# EAGLE design beba (EAGLE 9.6.2)
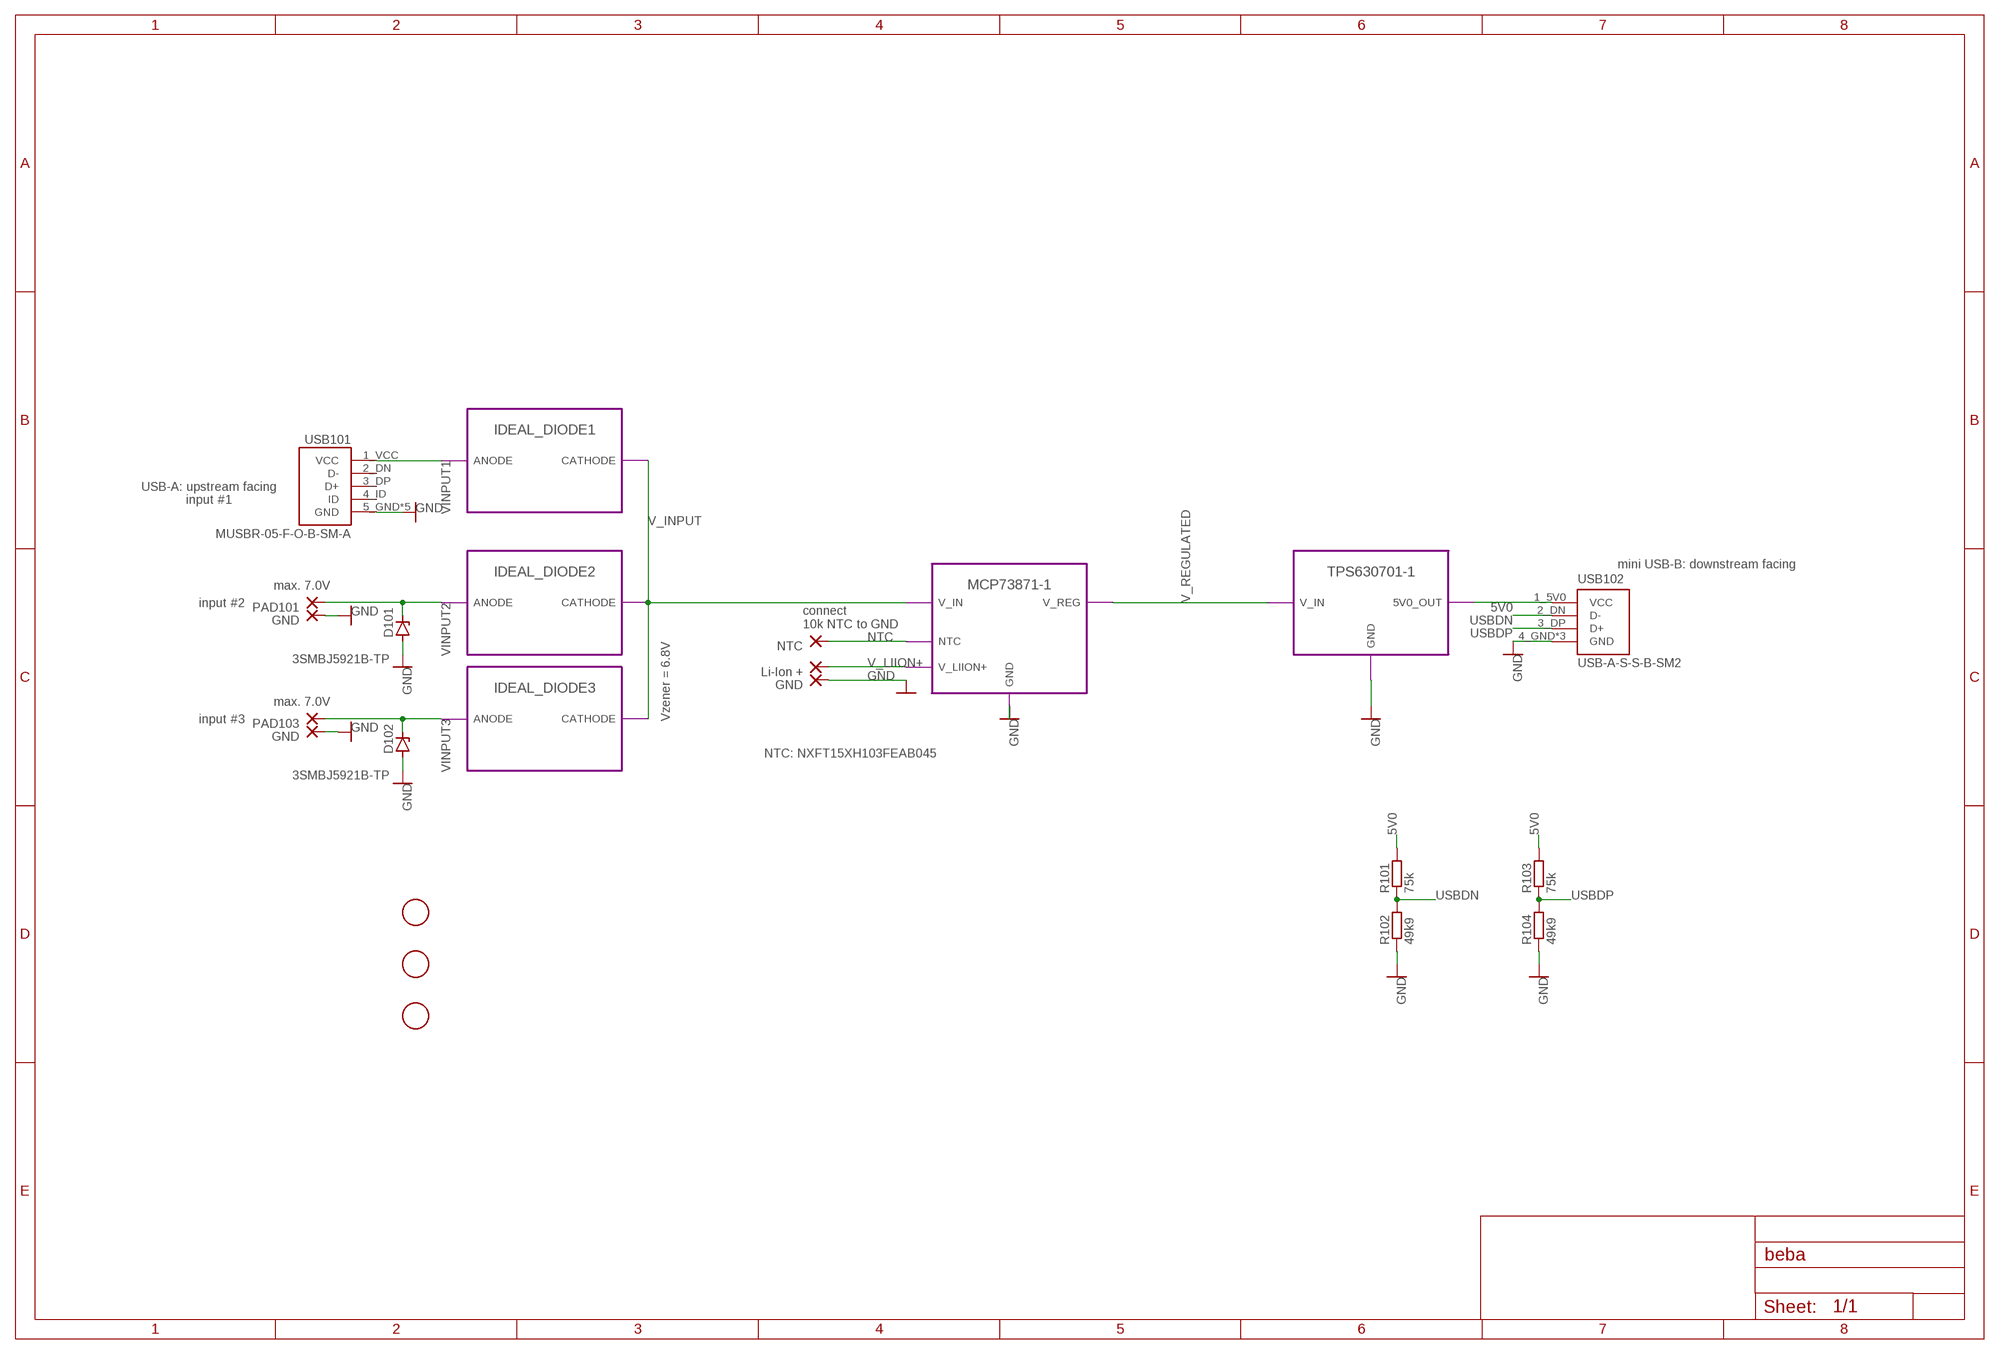
[diagram p0: schematic, sheet 1]

## Parts
D101  3SMBJ5921B-TP  ZENER-DIODEDO214AA  [DO214AA]
D102  3SMBJ5921B-TP  ZENER-DIODEDO214AA  [DO214AA]
FID1  fiducial  FIDUCIALFID_0.5MM  [FIDUCIAL_0.5MM]
FID2  fiducial  FIDUCIALFID_0.5MM  [FIDUCIAL_0.5MM]
FID3  fiducial  FIDUCIALFID_0.5MM  [FIDUCIAL_0.5MM]
PAD101  IN2  SMD5  [SMD2,54-5,08]
PAD102  GND  SMD5  [SMD2,54-5,08]
PAD103  IN3  SMD5  [SMD2,54-5,08]
PAD104  GND  SMD5  [SMD2,54-5,08]
PAD105  NTC  SMD5  [SMD2,54-5,08]
PAD106  Li-Ion +  SMD5  [SMD2,54-5,08]
PAD107  GND  SMD5  [SMD2,54-5,08]
R101  75k  R-EU_R0805  [R0805]
R102  49k9  R-EU_R0805  [R0805]
R103  75k  R-EU_R0805  [R0805]
R104  49k9  R-EU_R0805  [R0805]
USB101  MUSBR-05-F-O-B-SM-A  [SAMTEC_MUSBR-05-F-O-B-SM-A]
USB102  USB-A-S-S-B-SM2  USB-A-S-X-X-SM2  [SAMTEC_USB-A-S-X-X-SM2]

## Module instances
IDEAL_DIODE1 = 1_IDEAL_DIODE (part numbers offset by 200)
IDEAL_DIODE2 = 1_IDEAL_DIODE (part numbers offset by 300)
IDEAL_DIODE3 = 1_IDEAL_DIODE (part numbers offset by 400)
TPS630701-1 = 2_TPS630701 (part numbers offset by 600)
MCP73871-1 = 3_MCP73871 (part numbers offset by 500)

## Nets
5V0 [V_input]: R101.2 R103.2 USB102.1_5V0(VCC) ; port TPS630701-1.5V0_OUT
GND: D101.A D102.A PAD102.1(P) PAD104.1(P) PAD107.1(P) R102.1 R104.1 USB101.5_GND(GND) USB101.G1(GND) USB101.G2(GND) USB101.G3(GND) USB101.G4(GND) USB102.4_GND(GND) USB102.G1(GND) USB102.G2(GND) ; port TPS630701-1.GND MCP73871-1.GND
NTC: PAD105.1(P) ; port MCP73871-1.NTC
USBDN [other]: R101.1 R102.2 USB102.2_DN(D-)
USBDP [other]: R103.1 R104.2 USB102.3_DP(D+)
V_INPUT [V_input]: port IDEAL_DIODE1.CATHODE IDEAL_DIODE2.CATHODE IDEAL_DIODE3.CATHODE MCP73871-1.V_IN
V_LIION+ [V_input]: PAD106.1(P) ; port MCP73871-1.V_LIION+
V_REGULATED [V_input]: port MCP73871-1.V_REG TPS630701-1.V_IN
VINPUT1 [V_input]: USB101.1_VCC(VCC) ; port IDEAL_DIODE1.ANODE
VINPUT2 [V_input]: D101.C PAD101.1(P) ; port IDEAL_DIODE2.ANODE
VINPUT3 [V_input]: D102.C PAD103.1(P) ; port IDEAL_DIODE3.ANODE
Unconnected: USB101.2_DN(D-) USB101.3_DP(D+) USB101.4_ID(ID)

## Notes on the sheet
- USB-A: upstream facing
- input #1
- mini USB-B: downstream facing
- max. 7.0V
- input #2
- connect 
  10k NTC to GND
- Vzener = 6.8V
- max. 7.0V
- input #3
- NTC: NXFT15XH103FEAB045

## Library data of the parts
D101 D102 = diode:ZENER-DIODE: Z-Diode
FID1-FID3 = fiducials:FIDUCIAL
PAD101-PAD107 = wirepad:SMD5: SMD PAD
R101-R104 = resistor:R-EU_: RESISTOR, European symbol
USB101 = MUSBR-05-F-O-B-SM-A - Mini USB B Jack:MUSBR-05-F-O-B-SM-A: USB - mini B USB 2.0 Receptacle Connector 5 Position Surface Mount, Right Angle Check availability <https://pricing.snapeda.com/parts/MUSBR-05-F-O-B-SM-A/Samtec%20Inc./view-part?ref=eda>; AVAILABILITY: In Stock; DESCRIPTION: USB - mini B USB 2.0 Receptacle Connector 5 Position Surface Mount, Right Angle; MF: Samtec Inc.; MP: MUSBR-05-F-O-B-SM-A; PACKAGE: None; PRICE: None; PURCHASE-URL: https://pricing.snapeda.com/search/part/MUSBR-05-F-O-B-SM-A/?ref=eda
USB102 = USB-A-S-S-B-SM2 - USB A Jack:USB-A-S-X-X-SM2: USB-A (USB TYPE-A) USB 2.0 Receptacle Connector 4 Position Surface Mount, Right Angle; Through Hole Check availability <https://pricing.snapeda.com/parts/USB-A-S-S-B-SM2/Samtec%20Inc./view-part?ref=eda>; AVAILABILITY: In Stock; DESCRIPTION: USB-A (USB TYPE-A) USB 2.0 Receptacle Connector 4 Position Surface Mount, Right Angle; MF: Samtec Inc.; MP: USB-A-S-S-B-SM2; PACKAGE: None; PRICE: None; PURCHASE-URL: https://pricing.snapeda.com/search/part/USB-A-S-S-B-SM2/?ref=eda

## Module 1_IDEAL_DIODE
Ports: ANODE(pwr) CATHODE(pwr)
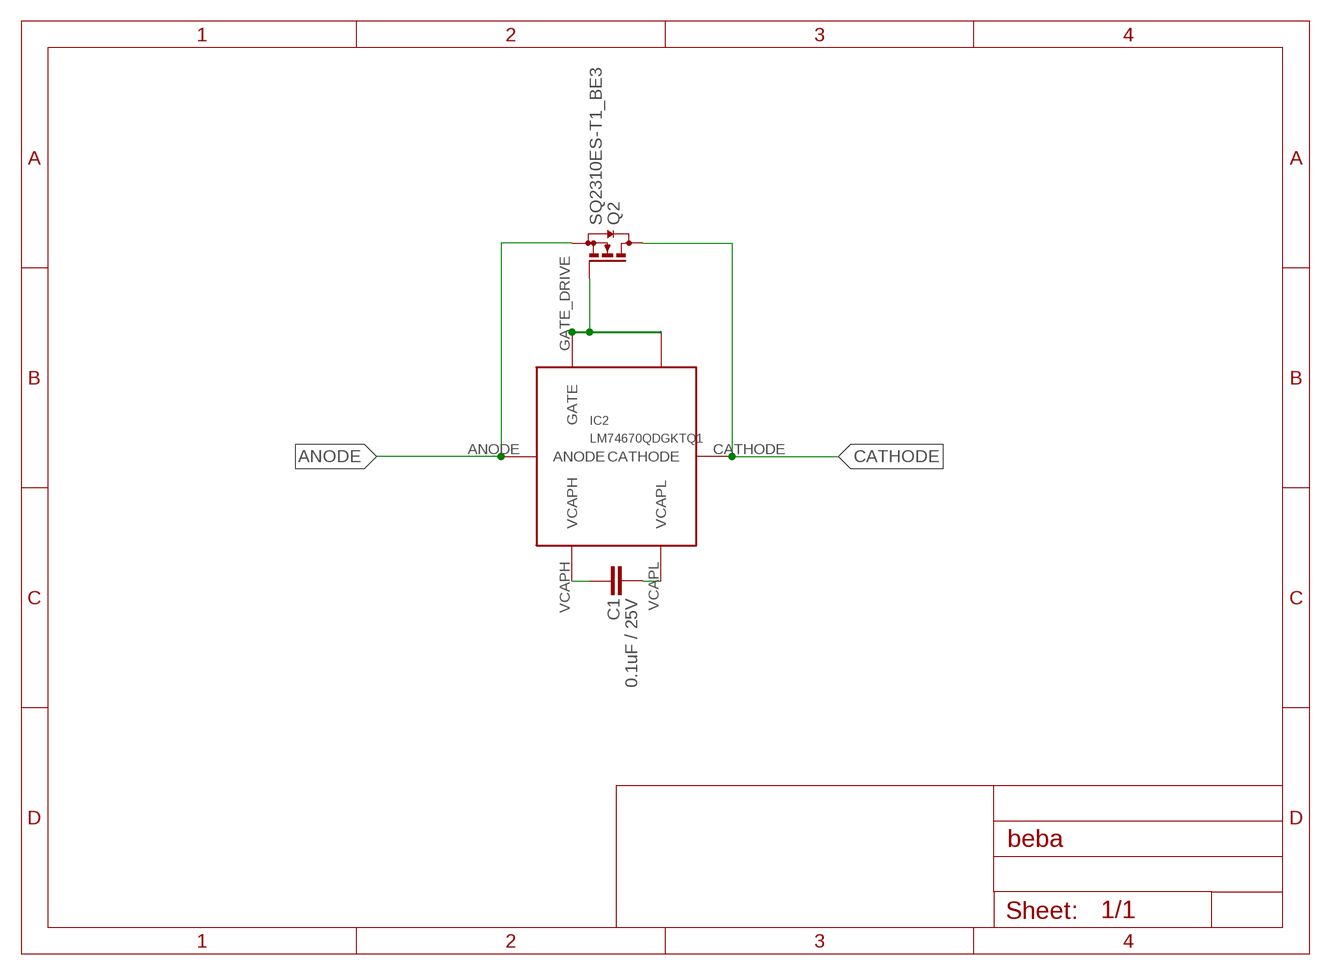
[diagram p1: schematic, module 1_IDEAL_DIODE, sheet 1]

### Parts
C1  0.1uF / 25V  C-EUC0805  [C0805]
IC2  LM74670QDGKTQ1  LM74670  [VSSOP-8]
Q2  SQ2310ES-T1_BE3  BSS123  [SOT23]

### Nets
ANODE: IC2.ANODE Q2.2(S)
CATHODE: IC2.CATHODE Q2.3(D)
GATE_DRIVER [other]: IC2.GATE_DRIVE(GATE) IC2.GATE_PULLD Q2.1(G)
VCAPH [other]: C1.2 IC2.VCAPH
VCAPL [other]: C1.1 IC2.VCAPL

### Library data of the parts
C1 = rcl:C-EU: CAPACITOR, European symbol; SPICEPREFIX: C
IC2 = LM74670 - Smart Diode Rectifier Controller:LM74670
Q2 = transistor-small-signal:BSS123: N-CHANNEL MOS FET

## Module 2_TPS630701
Ports: GND(pwr) V_IN(pwr) 5V0_OUT(pwr)
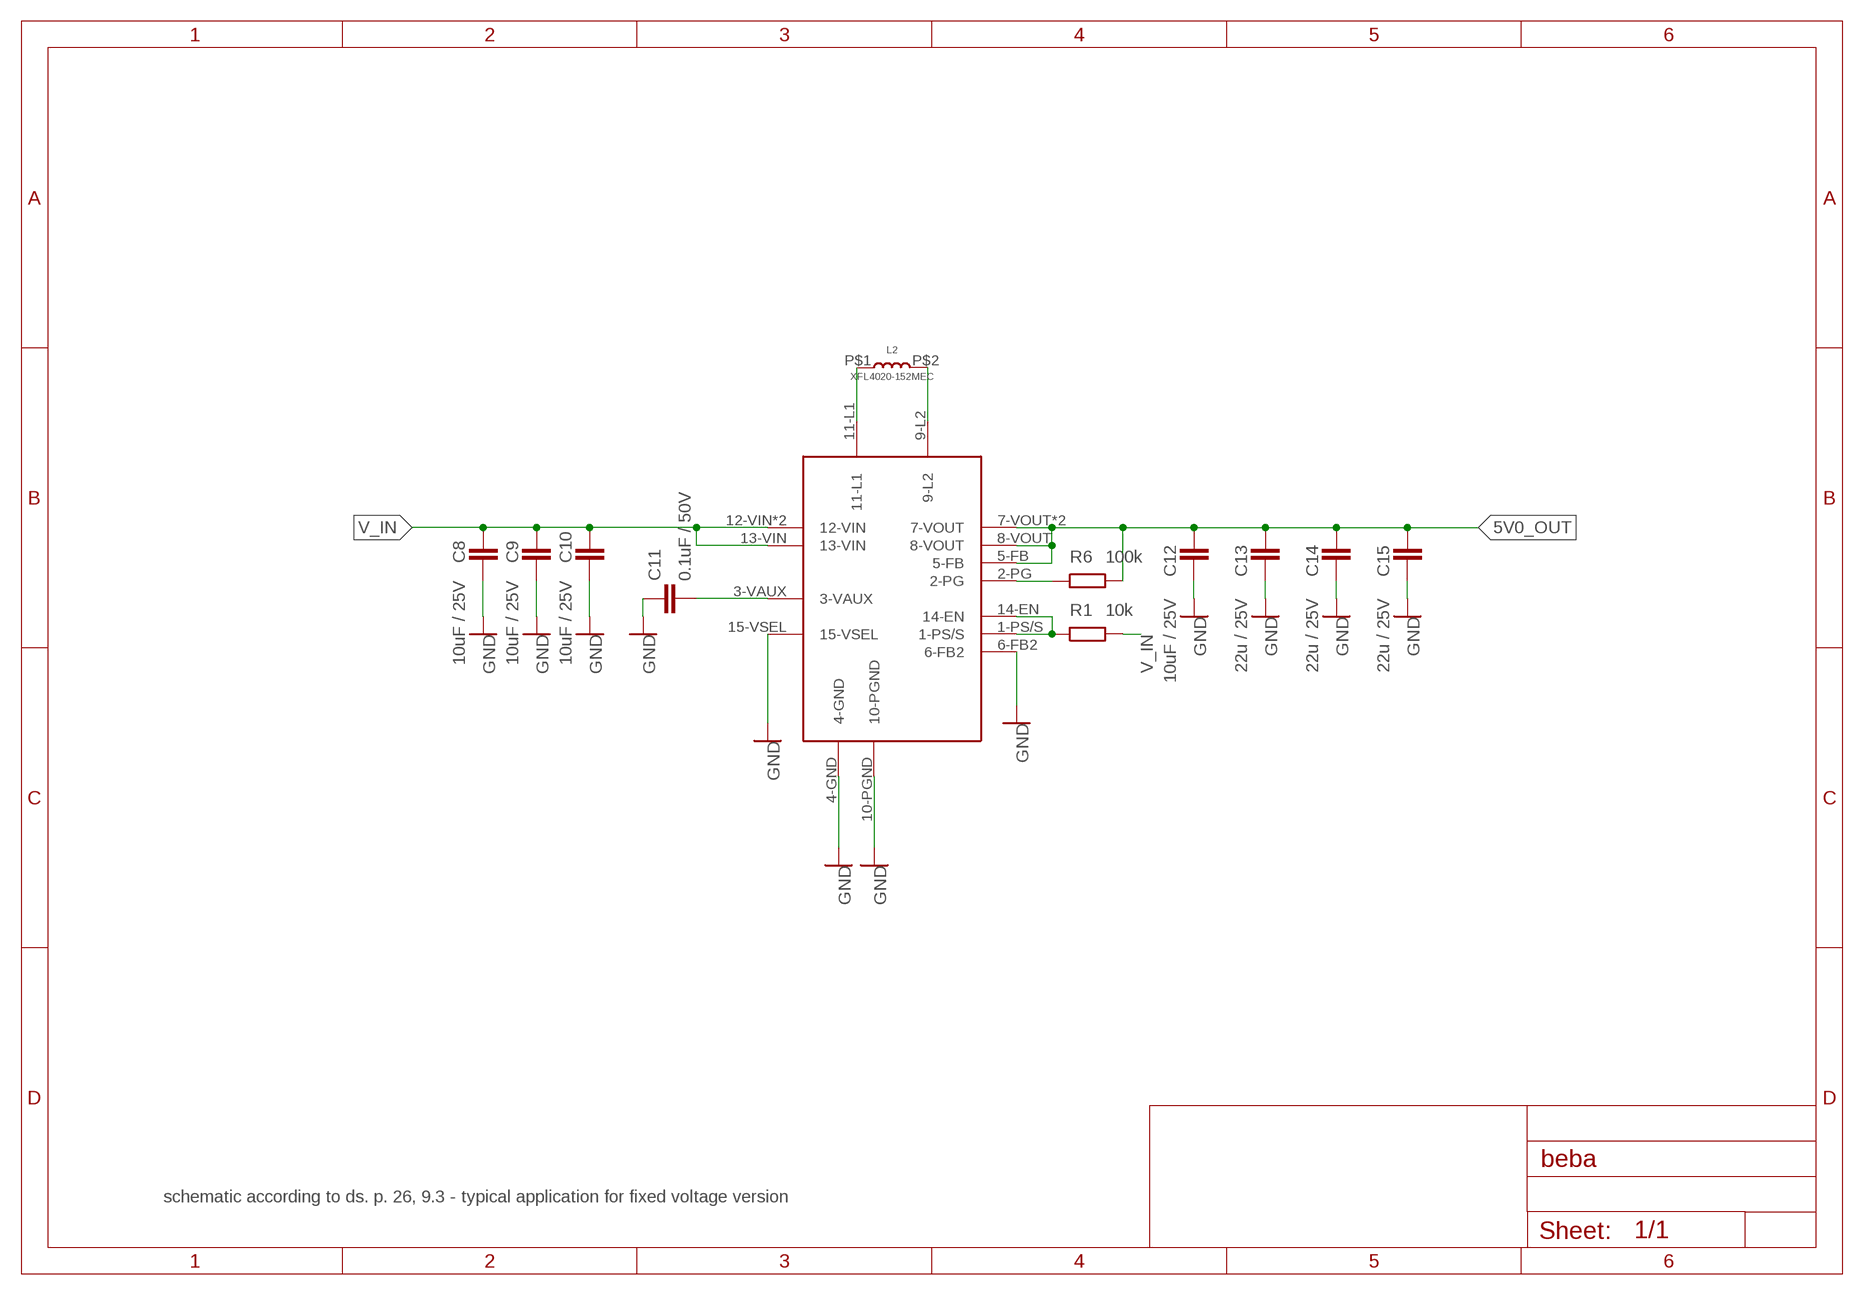
[diagram p2: schematic, module 2_TPS630701, sheet 1]

### Parts
C8  10uF / 25V  C-EUC0805  [C0805]
C9  10uF / 25V  C-EUC0805  [C0805]
C10  10uF / 25V  C-EUC0805  [C0805]
C11  0.1uF / 50V  C-EUC0805  [C0805]
C12  10uF / 25V  C-EUC0805  [C0805]
C13  22u / 25V  C-EUC0805  [C0805]
C14  22u / 25V  C-EUC0805  [C0805]
C15  22u / 25V  C-EUC0805  [C0805]
IC1  TPS630701RNMT  TPS630701  [VQFN]
L2  XFL4020-152MEC  [1616]
R1  10k  R-EU_R0805  [R0805]
R6  100k  R-EU_R0805  [R0805]

### Nets
5V0_OUT [V_input]: C12.2 C13.2 C14.2 C15.2 IC1.5-FB IC1.7-VOUT IC1.8-VOUT IC1.VOUT(7-VOUT) R6.2
GND: C8.1 C9.1 C10.1 C11.1 C12.1 C13.1 C14.1 C15.1 IC1.4-GND IC1.6-FB2 IC1.10-PGND IC1.15-VSEL
L1: IC1.11-L1 L2.P$1
L2: IC1.9-L2 L2.P$2
N$8 [other]: IC1.1-PS/S IC1.14-EN R1.1
PG1 [other]: IC1.2-PG R6.1
V_IN [V_input]: C8.2 C9.2 C10.2 IC1.12-VIN IC1.13-VIN IC1.VIN(12-VIN) R1.2
VAUX [other]: C11.2 IC1.3-VAUX

### Notes on the sheet
- schematic according to ds. p. 26, 9.3 - typical application for fixed voltage version

### Library data of the parts
C8-C15 = rcl:C-EU: CAPACITOR, European symbol; SPICEPREFIX: C
IC1 = TPS630701 - Buck Boost 5V regulator:TPS630701
L2 = XFL4020 - Inductor:XFL4020-152MEC
R1 R6 = resistor:R-EU_: RESISTOR, European symbol

## Module 3_MCP73871
Ports: GND(pwr) V_IN(pwr) V_LIION+(pwr) V_REG(pwr) NTC(hiz)
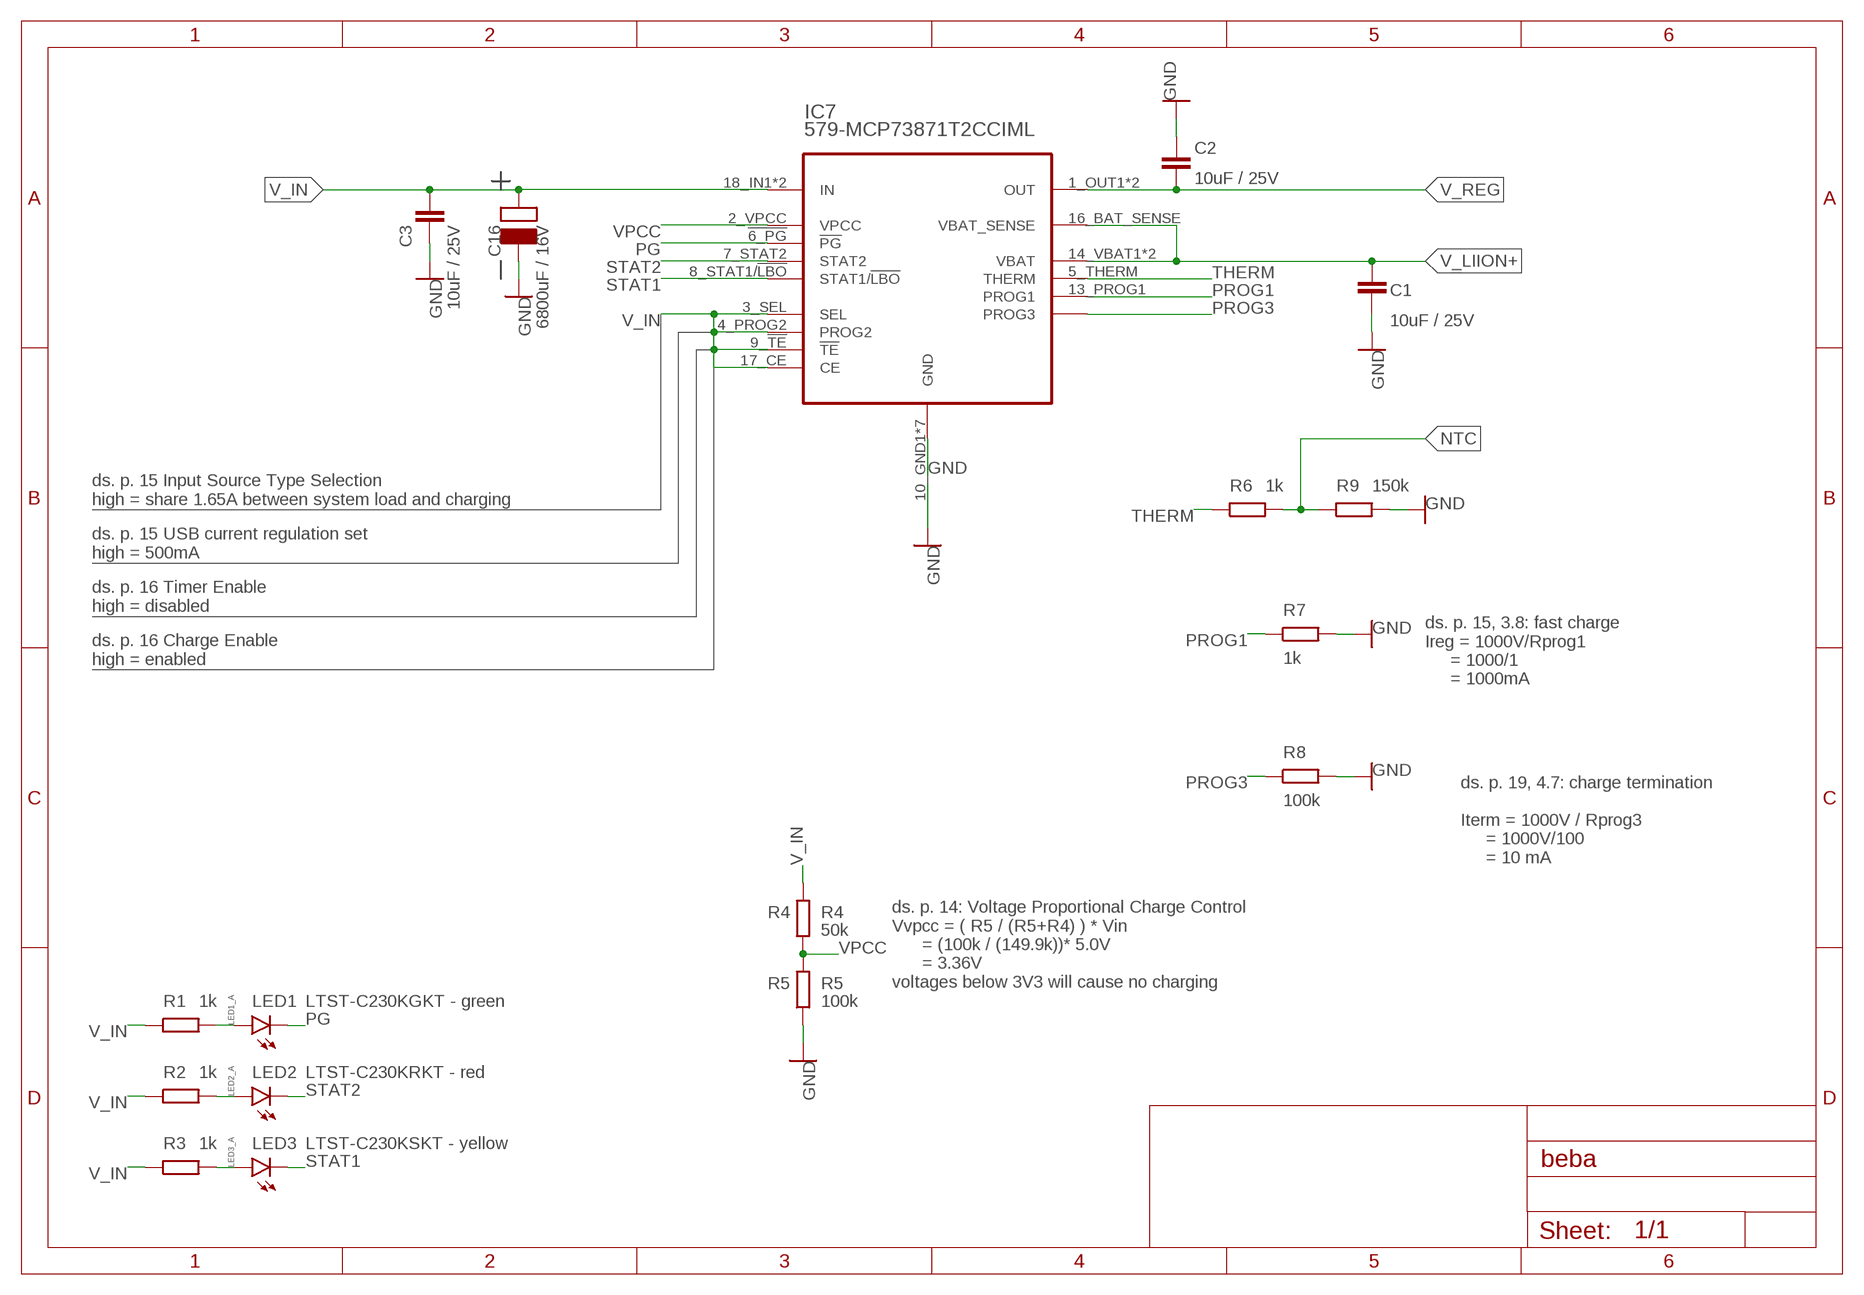
[diagram p3: schematic, module 3_MCP73871, sheet 1]

### Parts
C1  10uF / 25V  C-EUC0805  [C0805]
C2  10uF / 25V  C-EUC0805  [C0805]
C3  10uF / 25V  C-EUC0805  [C0805]
C16  6800uF / 16V  C-POL  [TH]
IC7  579-MCP73871T2CCIML  MCP73871-2AAI/ML  [QFN50P400X400X100-21N]
LED1  LTST-C230KGKT - green  LEDSML1206  [SML1206]
LED2  LTST-C230KRKT - red  LEDSML1206  [SML1206]
LED3  LTST-C230KSKT - yellow  LEDSML1206  [SML1206]
R1  1k  R-EU_R0805  [R0805]
R2  1k  R-EU_R0805  [R0805]
R3  1k  R-EU_R0805  [R0805]
R4  50k  R-EU_R0805  [R0805]
R5  100k  R-EU_R0805  [R0805]
R6  1k  R-EU_R0805  [R0805]
R7  1k  R-EU_R0805  [R0805]
R8  100k  R-EU_R0805  [R0805]
R9  150k  R-EU_R0805  [R0805]

### Nets
GND: C1.2 C2.2 C3.2 C16.NEG IC7.10_GND1(GND) IC7.11_GND2(GND) IC7.GND2(GND) IC7.GND3(GND) IC7.GND4(GND) IC7.GND5(GND) IC7.GND6(GND) R5.1 R7.2 R8.2 R9.2
LED1_A [other]: LED1.A R1.2
LED2_A [other]: LED2.A R2.2
LED3_A [other]: LED3.A R3.2
NTC [other]: R6.2 R9.1
PG [other]: IC7.!6_PG!(!PG!) LED1.C
PROG1 [other]: IC7.13_PROG1(PROG1) R7.1
PROG3 [other]: IC7.12_PROG3(PROG3) R8.1
STAT1 [other]: IC7.8_STAT1/!LBO!(STAT1/!LBO!) LED3.C
STAT2 [other]: IC7.7_STAT2(STAT2) LED2.C
THERM [other]: IC7.5_THERM(THERM) R6.1
V_IN [V_input]: C3.1 C16.POS IC7.3_SEL(SEL) IC7.4_PROG2(PROG2) IC7.9_!TE!(!TE!) IC7.17_CE(CE) IC7.18_IN1(IN) IC7.19_IN2(IN) R1.1 R2.1 R3.1 R4.2
V_LIION+ [V_input]: C1.1 IC7.14_VBAT1(VBAT) IC7.15_VBAT2(VBAT) IC7.16_BAT_SENSE(VBAT_SENSE)
V_REG [V_input]: C2.1 IC7.1_OUT1(OUT) IC7.20_OUT2(OUT)
VPCC [other]: IC7.2_VPCC(VPCC) R4.1 R5.2

### Notes on the sheet
- ds. p. 15 Input Source Type Selection
  high = share 1.65A between system load and charging
- ds. p. 15 USB current regulation set
  high = 500mA
- ds. p. 16 Timer Enable
  high = disabled
- ds. p. 15, 3.8: fast charge
  Ireg = 1000V/Rprog1
       = 1000/1
       = 1000mA
- ds. p. 16 Charge Enable
  high = enabled
- ds. p. 19, 4.7: charge termination
  
  Iterm = 1000V / Rprog3
       = 1000V/100
       = 10 mA
- ds. p. 14: Voltage Proportional Charge Control
  Vvpcc = ( R5 / (R5+R4) ) * Vin
        = (100k / (149.9k))* 5.0V
        = 3.36V
  voltages below 3V3 will cause no charging
- R4
- R5

### Library data of the parts
C1-C3 = rcl:C-EU: CAPACITOR, European symbol; SPICEPREFIX: C
C16 = C-Pol:C-POL
IC7 = MCP73871 - Powerpath and Charge Controller:MCP73871-2AAI/ML: IC, BATTERY CHARGER, 1A; MPN: MCP73871-2AAI/ML; OC_FARNELL: 1642487; OC_NEWARK: 54M4955; PACKAGE: QFN-20; SUPPLIER: Microchip
LED1-LED3 = led:LED: LED OSRAM: - CHIPLED LG R971, LG N971, LY N971, LG Q971, LY Q971, LO R971, LY R971 LH N974, LH R974 LS Q976, LO Q976, LY Q976 LO Q996 - Hyper CHIPLED LW Q18S LB Q993, LB Q99A, LB R99A - SideLED LS A670, LO A670, LY A670, LG A670, LP A670 LB A673, LV A673, LT A673, LW A673 LH A674 LY A675 LS A676, LA A676, LO A676, LY A676, LW A676 LS A679, LY A679, LG A679 - Hyper Micro SIDELED® LS Y876, LA Y876, LO Y876, LY Y876 LT Y87S - SmartLED LW L88C, LW L88S LB L89C, LB L89S, LG L890 LS L89K, LO L89K, LY L89K LS L896, LA L896, LO L896, LY L896 - TOPLED LS T670, LO T670, LY T670, LG T670, LP T670 LSG T670, LSP T670, LSY T670, LOP T670, LYG T670 LG T671, LOG T671, LSG T671 LB T673, LV T673, LT T673, LW T673 LH T674 LS T676, LA T676, LO T676, LY T676, LB T676, LH T676, LSB T676, LW T676 LB T67C, LV T67C, LT T67C, LS T67K, LO T67K, LY T67K, LW E67C LS E67B, LA E67B, LO E67B, LY E67B, LB E67C, LV E67C, LT E67C LW T67C LS T679, LY T679, LG T679 LS T770, LO T770, LY T770, LG T770, LP T770 LB T773, LV T773, LT T773, LW T773 LH T774 LS E675, LA E675, LY E675, LS T675 LS T776, LA T776, LO T776, LY T776, LB T776 LHGB T686 LT T68C, LB T68C - Hyper Mini TOPLED® LB M676 - Mini TOPLED Santana® LG M470 LS M47K, LO M47K, LY M47K Source: http://www.osram.convergy.de LUXEON: - LUMILED® LXK2-PW12-R00, LXK2-PW12-S00, LXK2-PW14-U00, LXK2-PW14-V00 LXK2-PM12-R00, LXK2-PM12-S00, LXK2-PM14-U00 LXK2-PE12-Q00, LXK2-PE12-R00, LXK2-PE12-S00, LXK2-PE14-T00, LXK2-PE14-U00 LXK2-PB12-K00, LXK2-PB12-L00, LXK2-PB12-M00, LXK2-PB14-N00, LXK2-PB14-P00, LXK2-PB14-Q00 LXK2-PR12-L00, LXK2-PR12-M00, LXK2-PR14-Q00, LXK2-PR14-R00 LXK2-PD12-Q00, LXK2-PD12-R00, LXK2-PD12-S00 LXK2-PH12-R00, LXK2-PH12-S00 LXK2-PL12-P00, LXK2-PL12-Q00, LXK2-PL12-R00 Source: www.luxeon.com KINGBRIGHT: KA-3528ASYC Source: www.kingbright.com
R1-R9 = resistor:R-EU_: RESISTOR, European symbol

## Net classes
0 GND: width 0.25 mm, drill 0.35 mm, clearance 0.2 mm
1 V_input: width 0.25 mm, drill 0.35 mm, clearance 0.2 mm
2 other: width 0.25 mm, drill 0.35 mm, clearance 0.2 mm

## Board
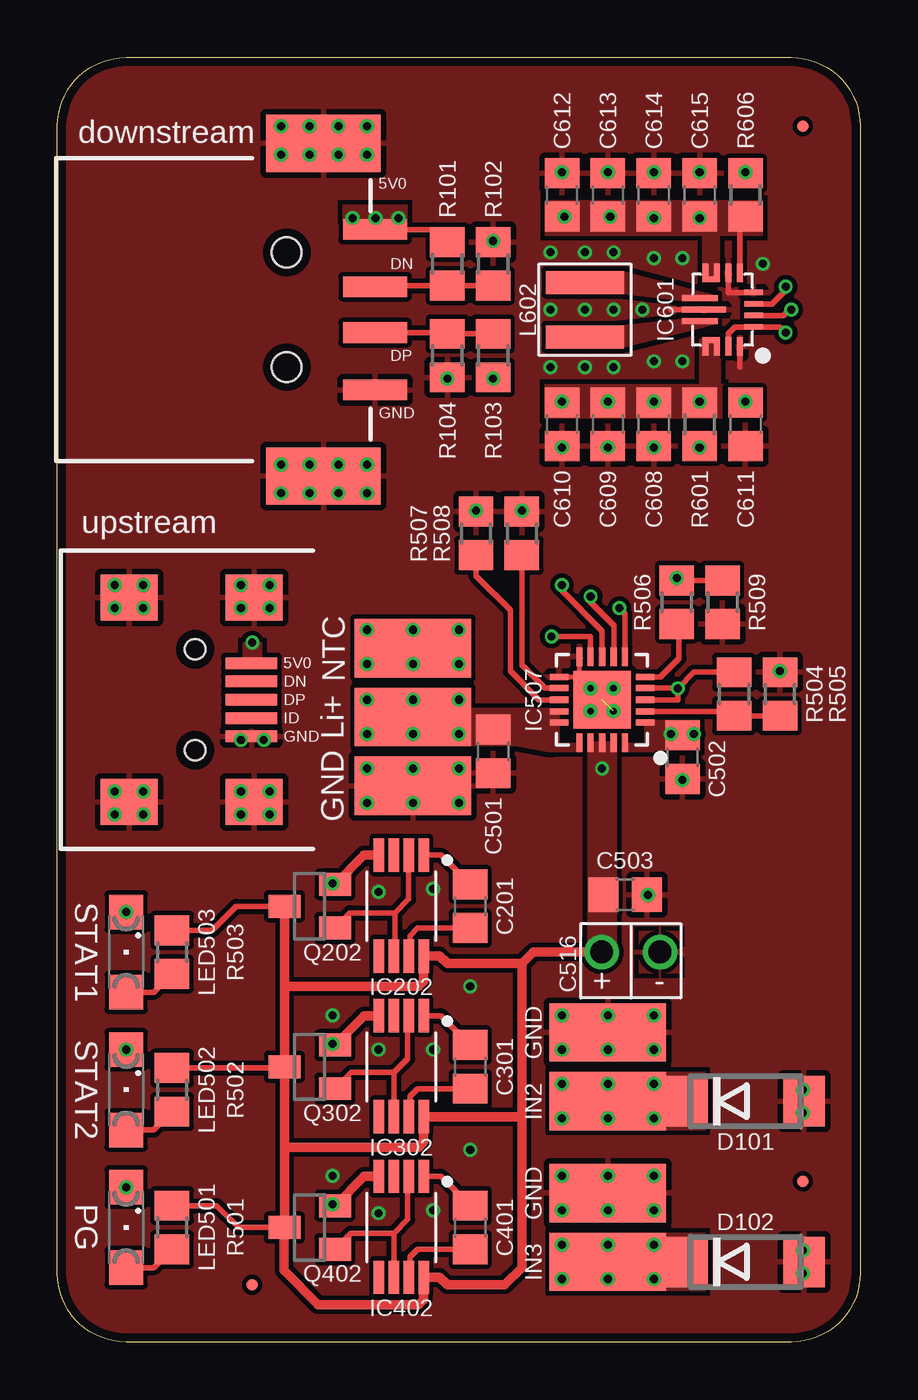
[diagram p4: board, top side]
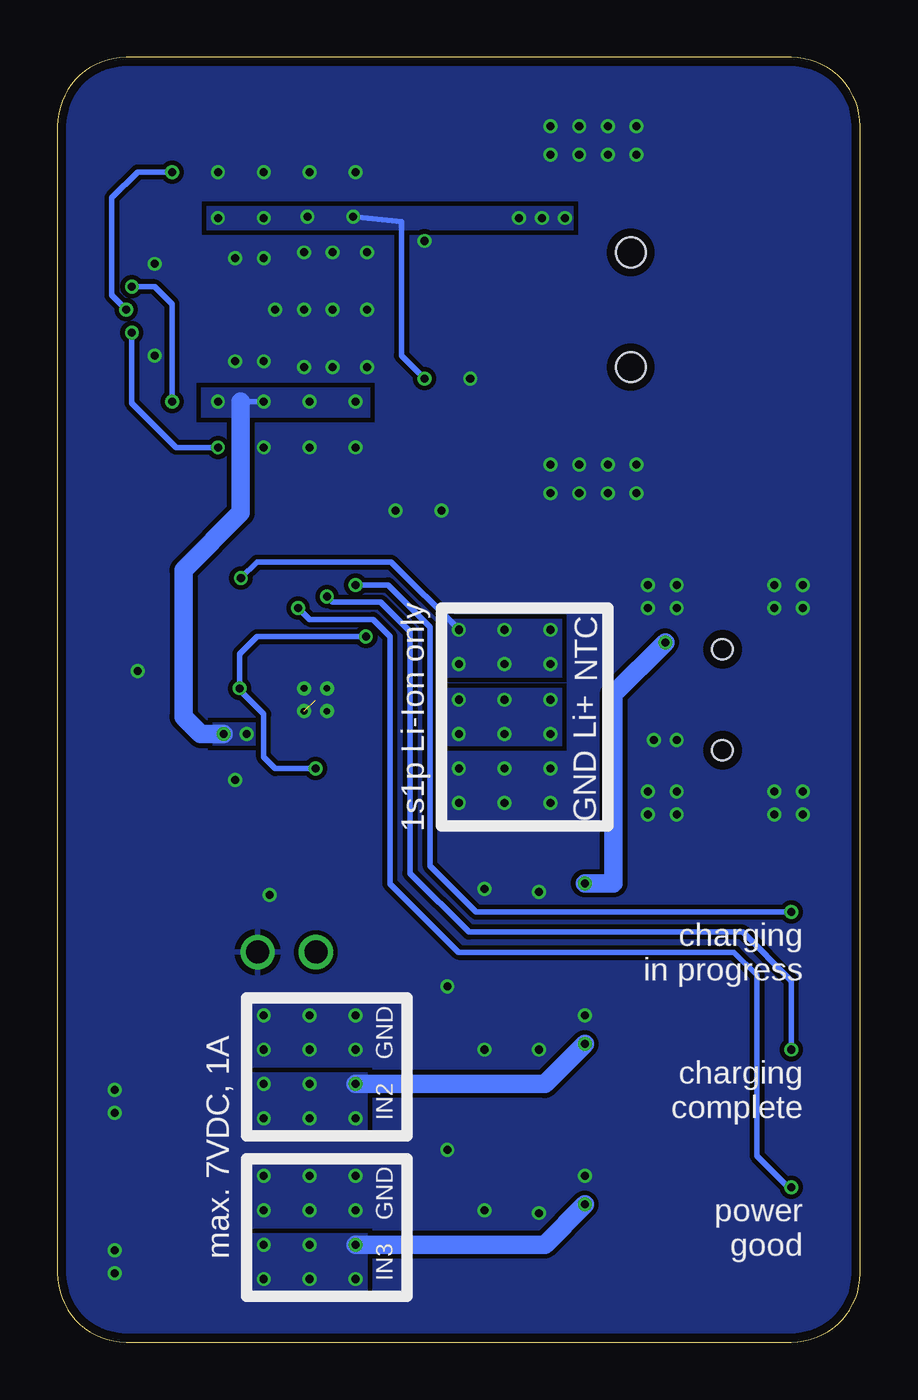
[diagram p5: board, bottom side, seen from below]

Size 35 x 56 mm. Coordinates in mm from the lower left corner, seen from the top.
Outline: 35,53 35,3 arc-90 32,0 3,0 arc-90 0,3 0,53 arc-90 3,56 32,56 arc-90 35,53
Copper layers (1*16): Top 0.035559375mm / dielectric 1.6mm / Bottom 0.035559375mm
Design rules "oshpark-2layer": minimum track width 6mil, minimum drill 10mil, track to track 6mil, track to pad 6mil, pad to pad 6mil, via to via 6mil, smd to smd 6mil, copper to edge 15mil, drill to drill 6mil, minimum pad ring 5mil, minimum via ring 5mil, stop-mask expansion 2.5mil, vias tented up to drill 0mil, thermal gap 10mil
tRestrict: area 23.5,12 to 24.5,12.2; area 23.5,5 to 24.5,5.2; area 15,25.5 to 16,25.8; area 22.4,27.5 to 22.5,28.5; area 25,27.4 to 25.1,28.4; area 23.3,29.2 to 24.3,29.3; area 23.2,26.7 to 24.2,26.8

### Footprints (pad centres in the part's own frame; a part is rotated, then mirrored left to right if it is on the bottom)
C0805 = smd 1.3 x 1.5: 1 -0.95,0; 2 0.95,0
TH = drill 1: NEG 1.27,0; POS -1.27,0
DO214AA = smd 1.8 x 2.2: A 2.55,0; C -2.55,0
FIDUCIAL_0.5MM = smd 0.5 x 0.5: FID 0,0
VSSOP-8 = smd 0.45 x 1.45: ANODE 0.98,-2.23; CATHODE -0.97,2.17; GATE_DRIVE 0.33,2.17; GATE_PULLD -0.32,-2.23; NC1 0.33,-2.23; NC2 0.98,2.17; VCAPH -0.32,2.17; VCAPL -0.97,-2.23
QFN50P400X400X100-21N = smd 0.8 x 0.275: 1_OUT1 -1.88,0.991; 2_VPCC -1.88,0.508; 3_SEL -1.88,0; 4_PROG2 -1.88,-0.508; 5_THERM -1.88,-0.991; 11_GND2 1.88,-0.991; 12_PROG3 1.88,-0.508; 13_PROG1 1.88,0; 14_VBAT1 1.88,0.508; 15_VBAT2 1.88,0.991 | smd 0.275 x 0.8: 7_STAT2 -0.508,-1.88; 8_STAT1/!LBO! 0,-1.88; 9_!TE! 0.508,-1.88; 10_GND1 0.991,-1.88; 16_BAT_SENSE 0.991,1.88; 17_CE 0.508,1.88; 18_IN1 0,1.88; 19_IN2 -0.508,1.88; 20_OUT2 -0.991,1.88; !6_PG! -0.991,-1.88 | smd 2.5 x 2.5: GND2 0,0 | drill 0.3 pad 0.61: GND3 -0.5,-0.5; GND4 0.5,-0.5; GND5 0.5,0.5; GND6 -0.5,0.5
VQFN = smd 0.8 x 0.25: 1-PS/S -1.35,0.75; 2-PG -1.35,0.25; 3-VAUX -1.35,-0.25; 4-GND -1.35,-0.75 | smd 0.25 x 0.8: 5-FB -0.75,-1.6; 6-FB2 -0.25,-1.6; 7-VOUT 0.25,-1.6; 8-VOUT 0.75,-1.6; 12-VIN 0.75,1.6; 13-VIN 0.25,1.6; 14-EN -0.25,1.6; 15-VSEL -0.75,1.6 | smd 1.55 x 0.25: 9-L2 0.99,-0.5; 11-L1 0.99,0.5 | smd 1.9 x 0.25: 10-PGND 0.815,0 | smd 0.6 x 0.25: VIN 0.5,1.325; VOUT 0.505,-1.325
1616 = smd 1 x 3.4: P$1 -1.185,0; P$2 1.185,0
SML1206 = smd 1.5 x 1.5: A 1.75,0; C -1.75,0
SMD2,54-5,08 = smd 2.54 x 5.08: 1 0,0
SOT23 = smd 1 x 1.4: 1 -0.95,-1.1; 2 0.95,-1.1; 3 0,1.1
R0805 = smd 1.3 x 1.5: 1 -0.95,0; 2 0.95,0
SAMTEC_MUSBR-05-F-O-B-SM-A = smd 0.5 x 2.25: 1_VCC 1.6,-2.46; 2_DN 0.8,-2.46; 3_DP 0,-2.46; 4_ID -0.8,-2.46; 5_GND -1.6,-2.46 | smd 2 x 2.5: G1 -4.45,2.87; G2 4.45,2.87; G3 -4.45,-2.58; G4 4.45,-2.58 | hole 0.9: -2.2,0; 2.2,0
SAMTEC_USB-A-S-X-X-SM2 = smd 0.9 x 2.8: 1_5V0 -3.5,3.85; 2_DN -1,3.85; 3_DP 1,3.85; 4_GND 3.5,3.85 | smd 2.5 x 5: G1 -7.25,1.6; G2 7.25,1.6 | hole 1.3: -2.5,0; 2.5,0

### Placement (x,y rotation side)
C201  0.1uF / 25V  [C0805]  18,19 270 top
C301  0.1uF / 25V  [C0805]  18,12 270 top
C401  0.1uF / 25V  [C0805]  18,5 270 top
C501  10uF / 25V  [C0805]  19,25.75 270 top
C502  10uF / 25V  [C0805]  27.25,25.5 270 top
C503  10uF / 25V  [C0805]  24.75,19.5 0 top
C516  6800uF / 16V  [TH]  25,17 0 top
C608  10uF / 25V  [C0805]  26,40 90 top
C609  10uF / 25V  [C0805]  24,40 90 top
C610  10uF / 25V  [C0805]  22,40 90 top
C611  0.1uF / 50V  [C0805]  30,40 90 top
C612  10uF / 25V  [C0805]  22,50 270 top
C613  22u / 25V  [C0805]  24,50 270 top
C614  22u / 25V  [C0805]  26,50 270 top
C615  22u / 25V  [C0805]  28,50 270 top
D101  30,10.5 0 top
D102  30,3.5 0 top
FID1  32.5,7 0 top
FID2  32.5,53 0 top
FID3  8.5,2.5 0 top
IC202  LM74670QDGKTQ1  [VSSOP-8]  15,19 180 top
IC302  LM74670QDGKTQ1  [VSSOP-8]  15,12 180 top
IC402  LM74670QDGKTQ1  [VSSOP-8]  15,5 180 top
IC507  579-MCP73871T2CCIML  [QFN50P400X400X100-21N]  23.75,28 180 top
IC601  TPS630701RNMT  [VQFN]  29,45 180 top
L602  XFL4020-152MEC  [1616]  23,45 90 top
LED501  LTST-C230KGKT - green  [SML1206]  3,5 270 top
LED502  LTST-C230KRKT - red  [SML1206]  3,11 270 top
LED503  LTST-C230KSKT - yellow  [SML1206]  3,17 270 top
PAD101  24,10.5 270 top
PAD102  24,13.5 270 top
PAD103  24,3.5 270 top
PAD104  24,6.5 270 top
PAD105  15.5,30.25 270 top
PAD106  15.5,27.25 90 top
PAD107  15.5,24.25 90 top
Q202  SQ2310ES-T1_BE3  [SOT23]  11,19 90 top
Q302  SQ2310ES-T1_BE3  [SOT23]  11,12 90 top
Q402  SQ2310ES-T1_BE3  [SOT23]  11,5 90 top
R101  17,47 90 top
R102  19,47 270 top
R103  19,43 270 top
R104  17,43 90 top
R501  1k  [R0805]  5,5 270 top
R502  1k  [R0805]  5,11 270 top
R503  1k  [R0805]  5,17 270 top
R504  50k  [R0805]  29.5,28.25 90 top
R505  100k  [R0805]  31.5,28.25 270 top
R506  1k  [R0805]  27,32.25 90 top
R507  1k  [R0805]  18.25,35.25 90 top
R508  100k  [R0805]  20.25,35.25 90 top
R509  150k  [R0805]  29,32.25 270 top
R601  10k  [R0805]  28,40 90 top
R606  100k  [R0805]  30,50 270 top
USB101  6,28 90 top
USB102  10,45 270 top

### Tracks (layer width: path | path; a pad name or v marks a point on that pad's centre or on a via)
5V0  (via drill 0.35)
  Top 0.25: IC601.5-FB 29.75,49.05 R606.2 | R103.2 v19,42 | USB102.1_5V0 13.88,48.5 | 13.88,48.5 16.45,48.5 R101.2 | v13.88,49 13.88,48.5
  Bottom 0.25: v19,42 20,43 20,48.85 v22.1,49.05
  other vias: 24.1,49.05 26,49 28,49 14.88,49 12.88,49
  pour Top (isolate 0.254, no thermals): 21.25,49.75 21.25,48.25 30.75,48.25 30.75,49.75
  pour Top (isolate 0.254, no thermals): 28.15,46.25 28.15,48.5 28.85,48.5 28.85,46.25
  pour Bottom (no thermals): 21.75,49.5 28.5,49.5 28.5,48.5 21.75,48.5
  pour Bottom (no thermals): 12.5,49.5 15.5,49.5 15.5,48.5 12.5,48.5
  pour Bottom (no thermals): 15.5,49.5 21.75,49.5 21.75,48.5 15.5,48.5
  pour Top (rank 2, no thermals): 12.45,48.93 12.45,49.57 15.25,49.57 15.25,48.93
GND  (via drill 0.35)  (1 unrouted)
  Top 0.2: IC507.10_GND1 22.76,28.99 IC507.11_GND2
  Top 0.25: IC601.6-FB2 29.25,45.75 IC601.4-GND | IC601.15-VSEL 29.75,42.5 | IC601.10-PGND 26.75,45
  other vias: 8,24 8,23 9.25,23 9.25,24 2.5,23 3.75,23 3.75,24 2.5,24 2.5,33 2.5,32 3.75,33 3.75,32 8,33 8,32 9.25,32 9.25,33 9.75,53 9.75,51.75 11,51.75 12.25,51.75 13.5,51.75 11,53 12.25,53 13.5,53 9.75,38.25 9.75,37 11,38.25 11,37 12.25,37 12.25,38.25 13.5,38.25 13.5,37 22,14.25 22,12.75 24,14.25 24,12.75 26,14.25 26,12.75 22,7.25 22,5.75 24,7.25 24,5.75 26,7.25 26,5.75 21.5,47.5 23,47.5 24.25,47.5 21.5,45 23,45 24.25,45 25.5,45 21.5,42.5 23,42.5 24.25,42.5 26,42.75 27.25,42.75 26,47.25 27.25,47.25 30.75,47 30.75,43 13.5,25 13.5,23.5 15.5,25 15.5,23.5 17.5,23.5 17.5,25 18,15.5 12,14.25 14,12.75 16.38,12.75 18,8.38 12,7.25 14,5.62 16.38,5.75 16.38,19.75 14,19.62 22,39 24,39 26,39 22,51 24,51 26,51 28,51 27.25,24.5 31.5,29.25 8,26.25 32.5,4 32.5,3 32.5,10 32.5,11 25.75,19.5 18.25,36.25 20.25,36.25 17,42 19,48 9,26.25
  pour Bottom (rank 6): -1,57 39,57 39,-1 -1,-1
  pour Top (rank 6): -1.75,58 37,58 37,-2 -1.75,-2
IDEAL_DIODE1:GATE_DRIVER
  Top 0.25: IC202.GATE_DRIVE 14.72,16.88 14.72,18.71 | IC202.GATE_PULLD 15.32,19.31 14.72,18.71 | Q202.1 12.76,18.71 14.72,18.71
IDEAL_DIODE1:VCAPH
  Top 0.25: IC202.VCAPH 15.37,16.88 15.37,17.71 15.71,18.05 C201.2
IDEAL_DIODE1:VCAPL
  Top 0.25: IC202.VCAPL 16.72,21.23 C201.1
IDEAL_DIODE2:GATE_DRIVER
  Top 0.25: IC302.GATE_PULLD 15.27,14.18 15.27,12.35 14.67,11.75 | IC302.GATE_DRIVE 14.67,11.75 | Q302.1 12.8,11.75 14.67,11.75
IDEAL_DIODE2:VCAPH
  Top 0.25: IC302.VCAPH 15.37,9.88 15.37,10.71 15.71,11.05 C301.2
IDEAL_DIODE2:VCAPL
  Top 0.25: IC302.VCAPL 16.72,14.23 C301.1
IDEAL_DIODE3:GATE_DRIVER
  Top 0.25: IC402.GATE_PULLD 15.27,7.18 15.27,5.35 14.67,4.75 | IC402.GATE_DRIVE 14.67,4.75 | Q402.1 12.8,4.75 14.67,4.75
IDEAL_DIODE3:VCAPH
  Top 0.25: IC402.VCAPH 15.37,2.88 15.37,3.71 15.71,4.05 C401.2
IDEAL_DIODE3:VCAPL
  Top 0.25: IC402.VCAPL 16.72,7.23 C401.1
MCP73871-1:LED1_A
  Top 0.25: LED501.A 4.2,3.25 R501.2
MCP73871-1:LED2_A
  Top 0.25: LED502.A 4.2,9.25 R502.2
MCP73871-1:LED3_A
  Top 0.25: LED503.A 4.2,15.25 R503.2
MCP73871-1:PG  (via drill 0.35)
  Top 0.25: IC507.!6_PG! 24.74,31.76 v24.5,32
  Bottom 0.25: v24.5,32 24,31.5 21.24,31.5 20.5,30.76 20.5,19.98 17.52,17 5.5,17 4.5,16 4.5,8.12 3.12,6.75 LED501.C
  other vias: 3,6.75
MCP73871-1:PROG1
  Top 0.25: IC507.13_PROG1 21,28 19.75,29.25 19.75,31.9 18.25,33.4 R507.1
MCP73871-1:PROG3
  Top 0.25: IC507.12_PROG3 21.25,28.51 20.25,29.51 R508.1
MCP73871-1:STAT1  (via drill 0.35)
  Top 0.25: IC507.8_STAT1/!LBO! 23.75,31 22,32.75 v22,33
  Bottom 0.25: v22,33 20.57,33 18.75,31.18 18.75,20.75 16.75,18.75 LED503.C
  other vias: 3,18.75
MCP73871-1:STAT2  (via drill 0.35)
  Top 0.25: IC507.7_STAT2 24.26,31.24 23.25,32.25 v23.25,32.5
  Bottom 0.25: v23.25,32.5 23,32.25 20.91,32.25 19.62,30.97 19.62,20.44 17.06,17.87 5.12,17.87 3,15.75 LED502.C
  other vias: 3,12.75
MCP73871-1:THERM
  Top 0.25: IC507.5_THERM 26.29,28.99 27.1,29.8 27.1,31.2 R506.1
MCP73871-1:VPCC
  Top 0.25: IC507.2_VPCC 29.31,27.49 R504.1 R505.2
NTC  (via drill 0.35)
  Top 0.25: R509.1 R506.2 v27,33.3 | PAD105.1 v15.5,29.55
  Bottom 0.25: v17.5,31.05 20.45,34 26.3,34 v27,33.3
  other vias: 13.5,31.05 13.5,29.55 15.5,31.05 17.5,29.55
  pour Bottom (no thermals): 13,31.5 18,31.5 18,29 13,29
TPS630701-1:L1
  pour Top (isolate 0.254, no thermals): 24.6,44.3 24.6,43.35 28.75,44.4 28.75,44.6 27.25,44.6
TPS630701-1:L2
  pour Top (isolate 0.254, no thermals): 24.65,46.65 24.65,45.75 24.65,45.7 27.25,45.4 28.75,45.4 28.75,45.6
TPS630701-1:N$8  (via drill 0.35)
  Top 0.25: IC601.14-EN 29.25,43.96 29.55,44.25 IC601.1-PS/S 31.5,44.25 v31.75,44 | R601.1 v28,39
  Bottom 0.25: v31.75,44 31.75,40.94 29.82,39 v28,39
TPS630701-1:PG1  (via drill 0.35)
  Top 0.25: IC601.2-PG 31.66,44.75 31.91,45 v32,45 | R606.1 v30,51
  Bottom 0.25: v30,51 31.5,51 32.62,49.88 32.62,45.62 v32,45
TPS630701-1:VAUX  (via drill 0.35)
  Top 0.25: v31.75,46 31.75,45.85 31.15,45.25 IC601.3-VAUX | C611.2 v30,41
  Bottom 0.25: v30,41 30,42.69 30,45.25 30.75,46 v31.75,46
USBDN
  Top 0.25: R102.2 R101.1 13.9,46.05 USB102.2_DN
USBDP
  Top 0.25: R103.1 R104.2 16.95,44 USB102.3_DP
V_INPUT  (via drill 0.35)
  Top 0.25: 9.9,11.75 Q302.3 9.85,11.95 R502.1 | IC507.9_!TE! 23.24,30.75 v21.55,30.75 | IC507.4_PROG2 v27.04,28.51 v27.05,28.5 | v27.05,28.5 27.75,29.2 R504.2 | R503.1 6.75,17.95 7.8,19 Q202.3 | R501.1 6.95,5.95 7.9,5 Q402.3 9.88,4.97 | IC507.3_SEL 27.05,28 v27.05,28.5
  Top 0.406: Q302.3 9.9,15.5 | 9.9,15.5 Q202.3 | Q402.3 9.9,8.5 | 9.9,8.5 9.9,11.75 | 20.25,9.83 20.25,3.25 19.5,2.5 17,2.5 16.67,2.83 IC402.CATHODE 15.97,1.84 15.75,1.62 11.38,1.62 9.88,3.12 9.88,4.97 | 20.25,9.83 20.25,16.5 | 20.25,16.5 17,16.5 16.67,16.83 IC202.CATHODE 15.97,15.72 15.75,15.5 9.9,15.5 | 20.25,9.83 IC302.CATHODE 15.97,8.72 15.75,8.5 9.9,8.5 | C516.POS 20.75,17 20.25,16.5
  Bottom 0.25: v21.55,30.75 26.3,30.75 27.05,30 v27.05,28.5 27.05,28.43 26,27.38 26,25.5 25.5,25 v23.75,25
  pour Top (no thermals): 23.1,25.78 24.4,25.78 24.4,25.72 23.1,25.72
  pour Top (no thermals): 22.97,17 24.4,17 24.4,26.15 23.1,26.15 23.1,17.53
  pour Bottom (no thermals): 25.35,17.9 27.15,17.9 27.15,16.1 25.35,16.1
V_INPUT1
  pour Top (no thermals): 27.15,17.9 25.35,17.9 25.35,16.1 27.15,16.1
V_LIION+  (via drill 0.35)
  Top 0.25: PAD106.1 v15.5,28
  other vias: 13.5,28 13.5,26.5 15.5,26.5 17.5,28 17.5,26.5
  pour Top (isolate 0.254, no thermals): 19,27.35 19,27 19,26
  pour Top (no thermals): 21.88,27.62 21.88,26.12 22.65,26.12 22.65,25.72 21.48,25.72 21.48,27.62
  pour Bottom (no thermals): 13,28.5 18,28.5 18,26 13,26
  pour Top (no thermals): 17.62,26 19.95,26.01 21.48,25.72 21.48,27.62 17.62,27.62
V_REGULATED  (via drill 0.35)
  Bottom 0.25: v26,41 27,41
  Bottom 0.813: 27,41 27,36.15 29.5,33.65 29.5,27.25 28.75,26.5 v27.75,26.5
  other vias: 26.75,26.5 22,41 24,41 28,41
  pour Top (isolate 0.254, no thermals): 21.25,41.75 30.75,41.75 30.75,40.25 21.25,40.25
  pour Top (isolate 0.254, no thermals): 28,43.75 28.9,43.75 28.9,41.25 28,41.25
  pour Top (no thermals): 24.8,26.12 25.62,26.12 25.62,27.15 26.02,27.15 26.02,25.72 24.8,25.72
  pour Top (no thermals): 26.02,27.15 26.02,25.8 28,25.8 28,27.15
  pour Bottom (no thermals): 21.4,41.6 21.4,40.3 28.7,40.3 28.7,41.6
  pour Bottom (no thermals): 26.3,27 26.3,26 28.2,26 28.2,27
VINPUT1  (via drill 0.35)
  Top 0.25: Q202.2 12,19.95 v12,20
  Top 0.406: Q202.2 13.38,21.23 IC202.ANODE
  Bottom 0.813: v12,20 10.75,20 10.75,28.25 v8.5,30.5
  pour Top (no thermals): 8.1,30.5 8.9,30.5 8.9,29.8 8.1,29.8
VINPUT2  (via drill 0.35)
  Top 0.25: v24,9.75 PAD101.1 v24,11.25 | 26,10.5 v26,9.75 | 22,10.5 v22,9.75 | Q302.2 12,12.95 v12,13
  Top 0.406: Q302.2 13.38,14.23 IC302.ANODE
  Bottom 0.813: v22,11.25 13.75,11.25 v12,13
  other vias: 26,11.25
  pour Bottom: 21.5,9.25 26.5,9.25 26.5,11.75 21.5,11.75
  pour Top (no thermals): 21.5,11.75 21.5,9.25 28.25,9.25 28.25,11.75
VINPUT3  (via drill 0.35)
  Top 0.25: Q402.2 12,5.95 v12,6
  Top 0.406: Q402.2 13.38,7.23 IC402.ANODE
  Bottom 0.813: v22,4.25 13.75,4.25 v12,6
  other vias: 22,2.75 26,2.75 26,4.25 24,4.25 24,2.75
  pour Top (no thermals): 21.5,4.75 21.5,2.25 28.25,2.25 28.25,4.75
  pour Bottom: 21.5,4.75 21.5,2.25 26.5,2.25 26.5,4.75

### Text on the board
tPlace: downstream | upstream | NTC | Li+ | GND | STAT1 | STAT2 | PG
bPlace: NTC | Li+ | 1s1p Li-Ion only | GND | charging / in progress | charging / complete | max. 7VDC, 1A | power / good
tNames: GND | IN2 | GND | IN3
bNames: GND | IN2 | GND | IN3
tStop: ejovrh | beba / rev.1